# EAGLE design flying-horse-foot (EAGLE 9.6.2)
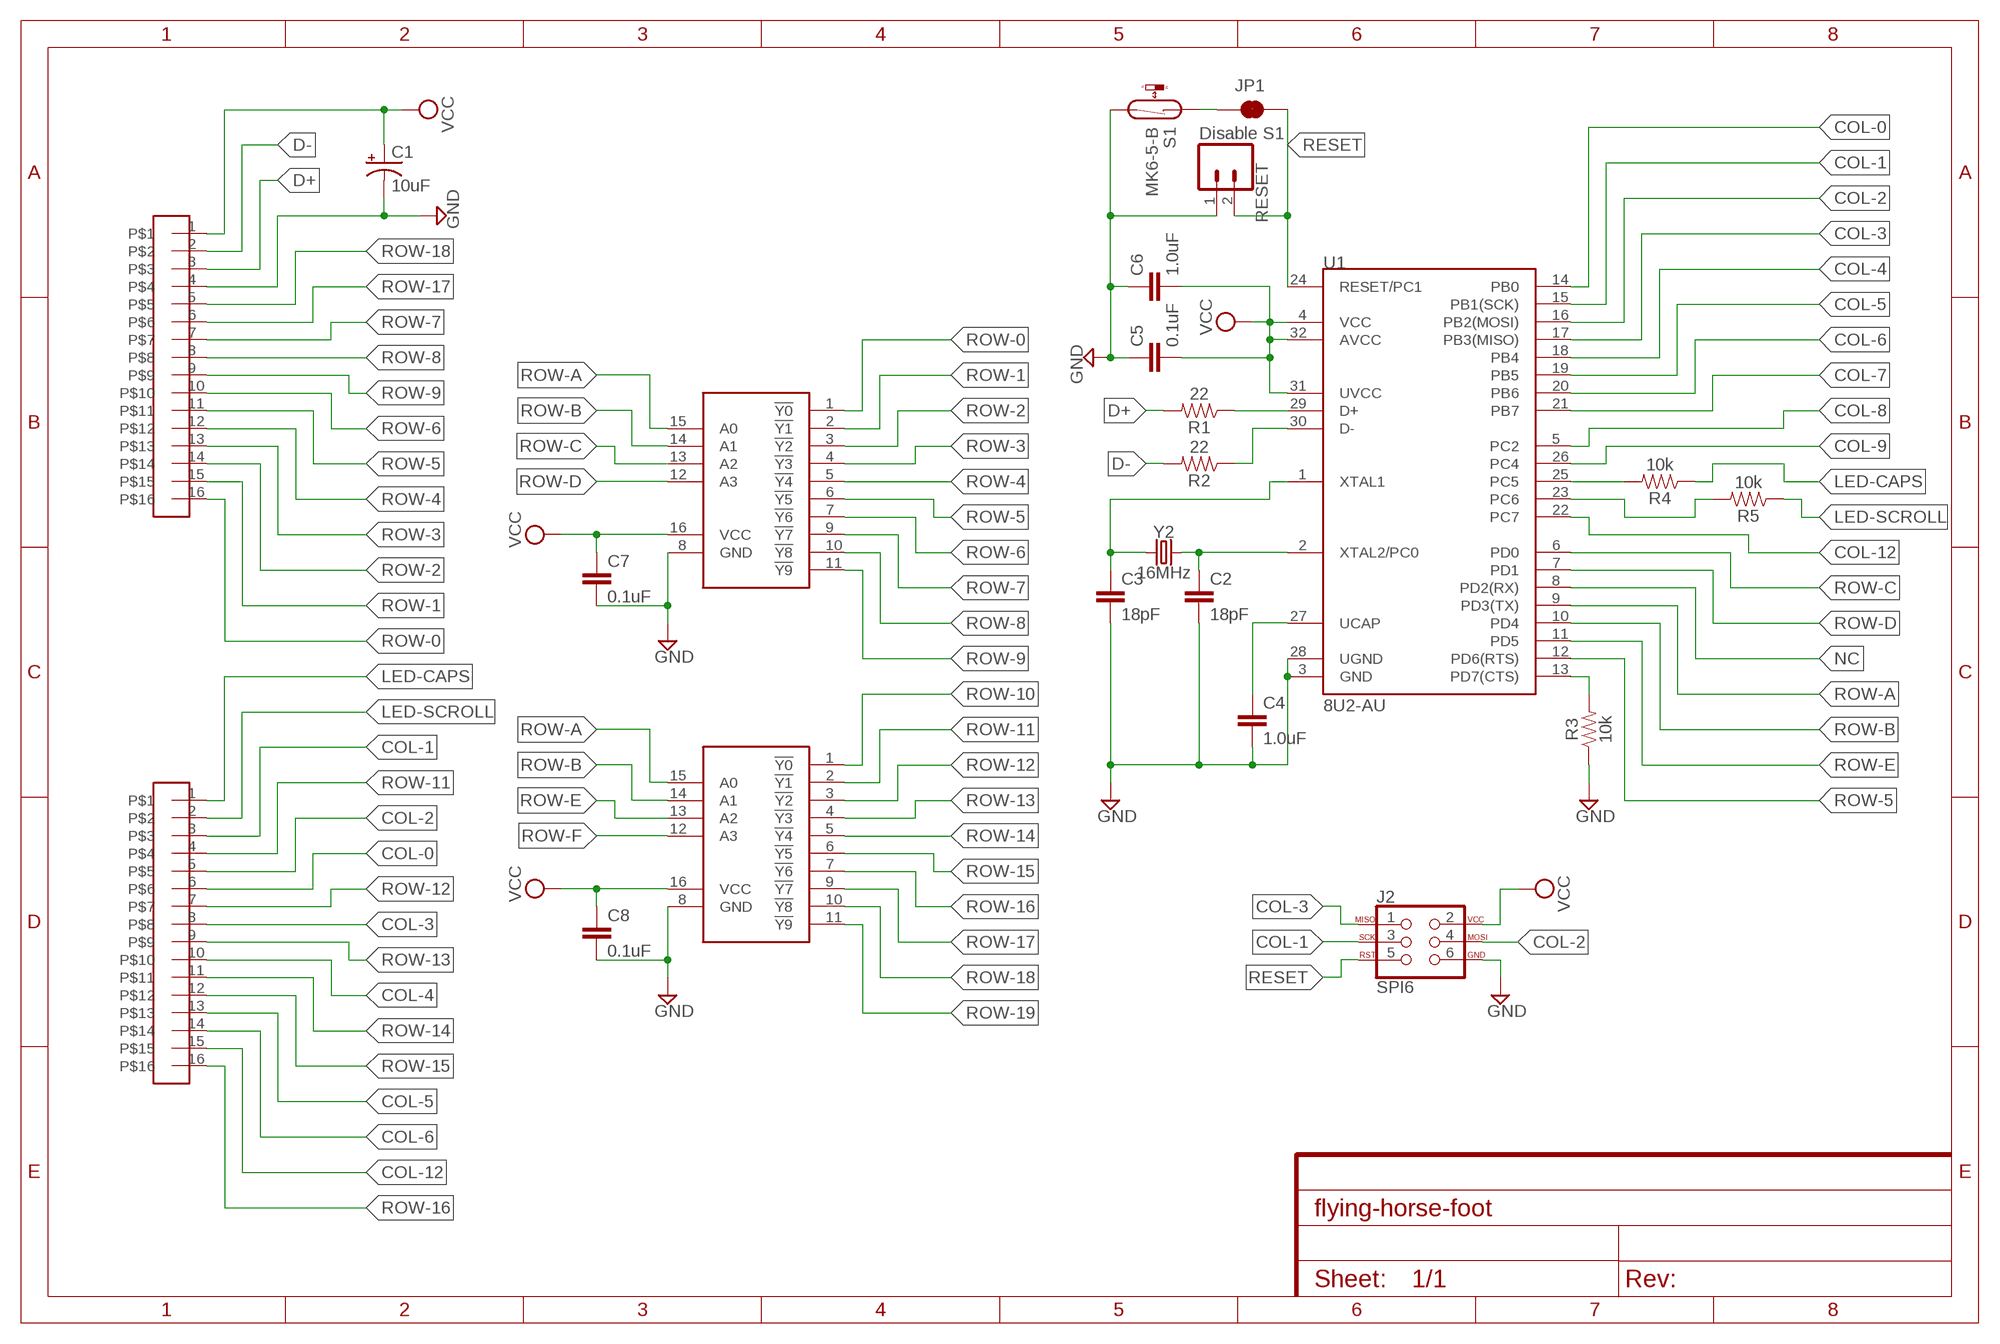
[diagram p0: schematic, sheet 1]

## Parts
C1  10uF  EEE-1CA100SR-EIA3528-20V-10%(TANT)  [EEE-1CA100SR]
C2  18pF  18PF-0603-50V-5%  [0603]
C3  18pF  18PF-0603-50V-5%  [0603]
C4  1.0uF  1.0UF-0603-16V-10%  [0603]
C5  0.1uF  0.1UF-0603-25V-5%  [0603]
C6  1.0uF  1.0UF-0603-16V-10%  [0603]
C7  0.1uF  0.1UF-0603-25V-5%  [0603]
C8  0.1uF  0.1UF-0603-25V-5%  [0603]
J2  SPI6  AVR_SPI_PROG_3X2NS  [2X3-NS]
JP1  Disable S1  JUMPER-SMT_2_NC_TRACE_NO-SILK  [SMT-JUMPER_2_NC_TRACE_NO-SILK]
R1  22  22OHM-0603-1/10W-1%  [0603]
R2  22  22OHM-0603-1/10W-1%  [0603]
R3  10k  10KOHM-0603-1/10W-1%  [0603]
R4  10k  10KOHM-0603-1/10W-1%  [0603]
R5  10k  10KOHM-0603-1/10W-1%  [0603]
RESET  CONN_02  [1X02]
S1  MK6-5-B  REED-SWITCH-MK6-5-B  [MK6-5]
U1  8U2-AU  ATMEGA8U2AU  [TQFP32-08_MCU]
U$1  74HC42D16  [D16]
U$2  74HC42D16  [D16]
U$3  16PIN-2MM-HEADER  [16PIN-2MM-HEADER]
U$4  16PIN-2MM-HEADER  [16PIN-2MM-HEADER]
Y2  16MHz  CRYSTAL-16MHZSMD-5X3.2  [CRYSTAL-SMD-5X3.2-4PAD]

## Nets
COL-0: U1.14(PB0) U$4.6
COL-1: J2.3 U1.15(PB1(SCK)) U$4.3
COL-2: J2.4 U1.16(PB2(MOSI)) U$4.5
COL-3: J2.1 U1.17(PB3(MISO)) U$4.8
COL-4: U1.18(PB4) U$4.10
COL-5: U1.19(PB5) U$4.13
COL-6: U1.20(PB6) U$4.14
COL-7: U1.21(PB7)
COL-8: U1.5(PC2)
COL-9: U1.26(PC4)
COL-12: U1.22(PC7) U$4.15
D+: R1.2 U$3.3
D-: R2.2 U$3.2
GND: C1.- C2.2 C3.2 C4.2 C5.1 C6.1 C7.2 C8.2 J2.6 R3.1 RESET.1 S1.2 U1.3(GND) U1.28(UGND) U$1.8(GND) U$2.8(GND) U$3.4
HWB: R3.2 U1.13(PD7(CTS))
LED-CAPS: R4.1 U$4.1
LED-SCROLL: R5.1 U$4.2
N$1: R1.1 U1.29(D+)
N$2: R2.1 U1.30(D-)
N$3: C2.1 U1.2(XTAL2/PC0) Y2.3
N$4: C3.1 U1.1(XTAL1) Y2.1
N$5: R4.2 U1.25(PC5)
N$6: C4.1 U1.27(UCAP)
N$7: R5.2 U1.23(PC6)
N$8: JP1.1 S1.1
NC: U1.8(PD2(RX))
RESET: J2.5 JP1.2 RESET.2 U1.24(RESET/PC1)
ROW-0: U$1.1(!Y0) U$3.16
ROW-1: U$1.2(!Y1) U$3.15
ROW-2: U$1.3(!Y2) U$3.14
ROW-3: U$1.4(!Y3) U$3.13
ROW-4: U$1.5(!Y4) U$3.12
ROW-5: U1.12(PD6(RTS)) U$1.6(!Y5) U$3.11
ROW-6: U$1.7(!Y6) U$3.10
ROW-7: U$1.9(!Y7) U$3.7
ROW-8: U$1.10(!Y8) U$3.8
ROW-9: U$1.11(!Y9) U$3.9
ROW-10: U$2.1(!Y0)
ROW-11: U$2.2(!Y1) U$4.4
ROW-12: U$2.3(!Y2) U$4.7
ROW-13: U$2.4(!Y3) U$4.9
ROW-14: U$2.5(!Y4) U$4.11
ROW-15: U$2.6(!Y5) U$4.12
ROW-16: U$2.7(!Y6) U$4.16
ROW-17: U$2.9(!Y7) U$3.6
ROW-18: U$2.10(!Y8) U$3.5
ROW-19: U$2.11(!Y9)
ROW-A: U1.9(PD3(TX)) U$1.15(A0) U$2.15(A0)
ROW-B: U1.10(PD4) U$1.14(A1) U$2.14(A1)
ROW-C: U1.6(PD0) U$1.13(A2)
ROW-D: U1.7(PD1) U$1.12(A3)
ROW-E: U1.11(PD5) U$2.13(A2)
ROW-F: U$2.12(A3)
VCC: C1.+ C5.2 C6.2 C7.1 C8.1 J2.2 U1.4(VCC) U1.31(UVCC) U1.32(AVCC) U$1.16(VCC) U$2.16(VCC) U$3.1

## Library data of the parts
C1 = aaa2:EEE-1CA100SR: 10.0µF polarized capacitors A capacitor is a passive two-terminal electrical component used to store electrical energy temporarily in an electric field.; PROD_ID: CAP-08063
C2 C3 = SparkFun-Capacitors:18PF: 18pF ceramic capacitors A capacitor is a passive two-terminal electrical component used to store electrical energy temporarily in an electric field.; PROD_ID: CAP-08267
C4 C6 = SparkFun-Capacitors:1.0UF: 1µF ceramic capacitors A capacitor is a passive two-terminal electrical component used to store electrical energy temporarily in an electric field.; PROD_ID: CAP-00868
C5 C7 C8 = SparkFun-Capacitors:0.1UF: 0.1µF ceramic capacitors A capacitor is a passive two-terminal electrical component used to store electrical energy temporarily in an electric field.; PROD_ID: CAP-08604
J2 = SparkFun-Connectors:AVR_SPI_PROG_3X2: AVR ISP 6 Pin This is the reduced ISP connector for AVR programming. Common on Arduino. This footprint will take up less PCB space and can be used with a 10-pin to 6-pin adapter such as SKU: BOB-08508 **Special note about "TEST_POINT" package. The stop mask is on the top side, so if you want your programming test points to be on the bottom of your board, make sure to place this package on the bottom side of the board. This also ensure that the orientation to program from the bottom side will be correct. SparkFun Products: SparkFun ISP Pogo Adapter <https://www.sparkfun.com/products/11591> - NS Tiny AVR Programmer <https://www.sparkfun.com/products/11801> -PTH
JP1 = SparkFun-Jumpers:JUMPER-SMT_2_NC_TRACE: Normally closed trace jumper This jumper has a trace between two pads so it's normally closed (NC). Use a razor knife to open the connection. For best results follow the IPC guidelines for cutting traces: Cutout at least 0.063 mm (0.005 in). Remove all loose material to clean up the cut area. Seal the cut with an approved epoxy. Reapply solder to reclose the connection.
R1 R2 = SparkFun-Resistors:22OHM: 22Ω resistor A resistor is a passive two-terminal electrical component that implements electrical resistance as a circuit element. Resistors act to reduce current flow, and, at the same time, act to lower voltage levels within circuits. - Wikipedia; PROD_ID: RES-08698
R3-R5 = SparkFun-Resistors:10KOHM: 10kΩ resistor A resistor is a passive two-terminal electrical component that implements electrical resistance as a circuit element. Resistors act to reduce current flow, and, at the same time, act to lower voltage levels within circuits. - Wikipedia; PROD_ID: RES-00824
RESET = SparkFun-Connectors:CONN_02: Multi connection point. Often used as Generic Header-pin footprint for 0.1 inch spaced/style header connections On any of the 0.1 inch spaced packages, you can populate with these: Break Away Headers - Straight <https://www.sparkfun.com/products/116> (PRT-00116) Break Away Male Headers - Right Angle <https://www.sparkfun.com/products/553> (PRT-00553) Female Headers <https://www.sparkfun.com/products/115> (PRT-00115) Break Away Headers - Machine Pin <https://www.sparkfun.com/products/117> (PRT-00117) Break Away Female Headers - Swiss Machine Pin <https://www.sparkfun.com/products/743> (PRT-00743) For SCREWTERMINALS and SPRING TERMINALS visit here: Screw Terimnals on SparkFun.com <https://www.sparkfun.com/search/results?term=Screw+Terminals> (5mm/3.5mm/2.54mm spacing) This device is also useful as a general connection point to wire up your design to another part of your project. Our various solder wires solder well into these plated through hole pads. Hook-Up Wire - Assortment (Stranded, 22 AWG) <https://www.sparkfun.com/products/11375> (PRT-11375) Hook-Up Wire - Assortment (Solid Core, 22 AWG) <https://www.sparkfun.com/products/11367> (PRT-11367) View the entire wire category on our website here <https://www.sparkfun.com/categories/141> Special notes: Molex polarized connector foot print use with: PRT-08233 with associated crimp pins and housings. 2.54_SCREWTERM for use with PRT-10571. 3.5mm Screw Terminal footprints for PRT-08084 5mm Screw Terminal footprints for use with PRT-08432
S1 = switch-reed:REED-SWITCH-: Reed Sensor; MF: MEDER; MPN: MK6-5-B; OC_FARNELL: 1079479
U1 = SparkFun-Retired:ATMEGA8U2: Atmel 32-pin 8-bit Microcontroller with 8/16/32K Bystes of ISP Flash and USB Controller. ATmega8U2, ATmega16U2, and ATmega32U2 Datasheet SparkFun Products Storefront component: ATMEGA8U2-AU <https://www.sparkfun.com/products/13703> (COM-13703); PROD_ID: IC-10104
U$1 U$2 = aaa2:74HC42
U$3 U$4 = aaa2:16PIN-2MM-HEADER
Y2 = SparkFun-Clocks:CRYSTAL-16MHZ: 16MHz Crystal Digikey Example <http://www.digikey.com/product-search/en?keywords=535-9122-1-ND> Frequency: 16MHz Frequency Stability: ±50ppm Frequency Tolerance: ±20ppm Load Capacitance: 18pF SparkFun Products: Pro Micro -5V/16MHz <https://www.sparkfun.com/products/12640> SparkFun Serial Enabled LCD Kit <https://www.sparkfun.com/products/10097>; PROD_ID: XTAL-08218; SF_ID: COM-00094

## Board
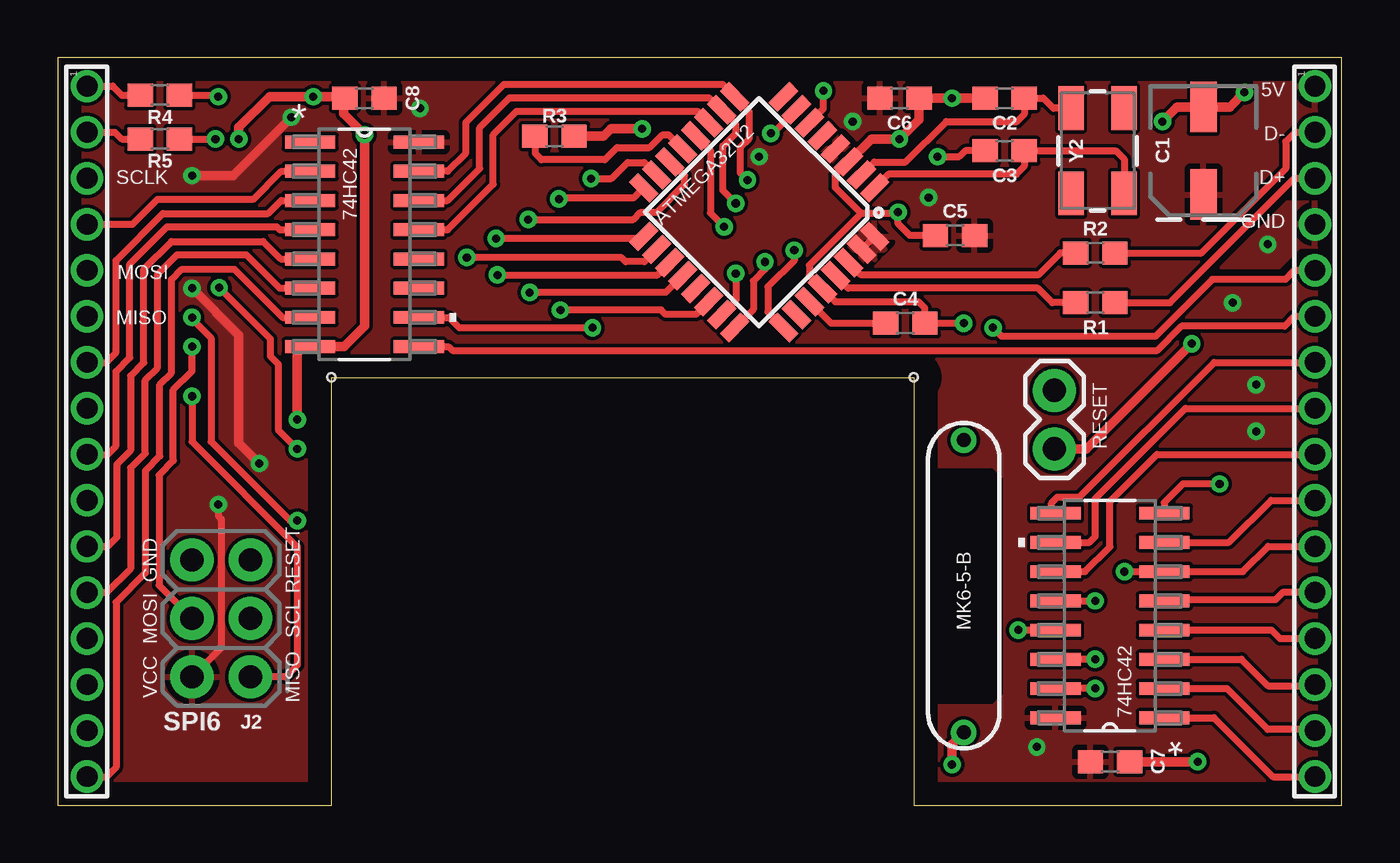
[diagram p1: board, top side]
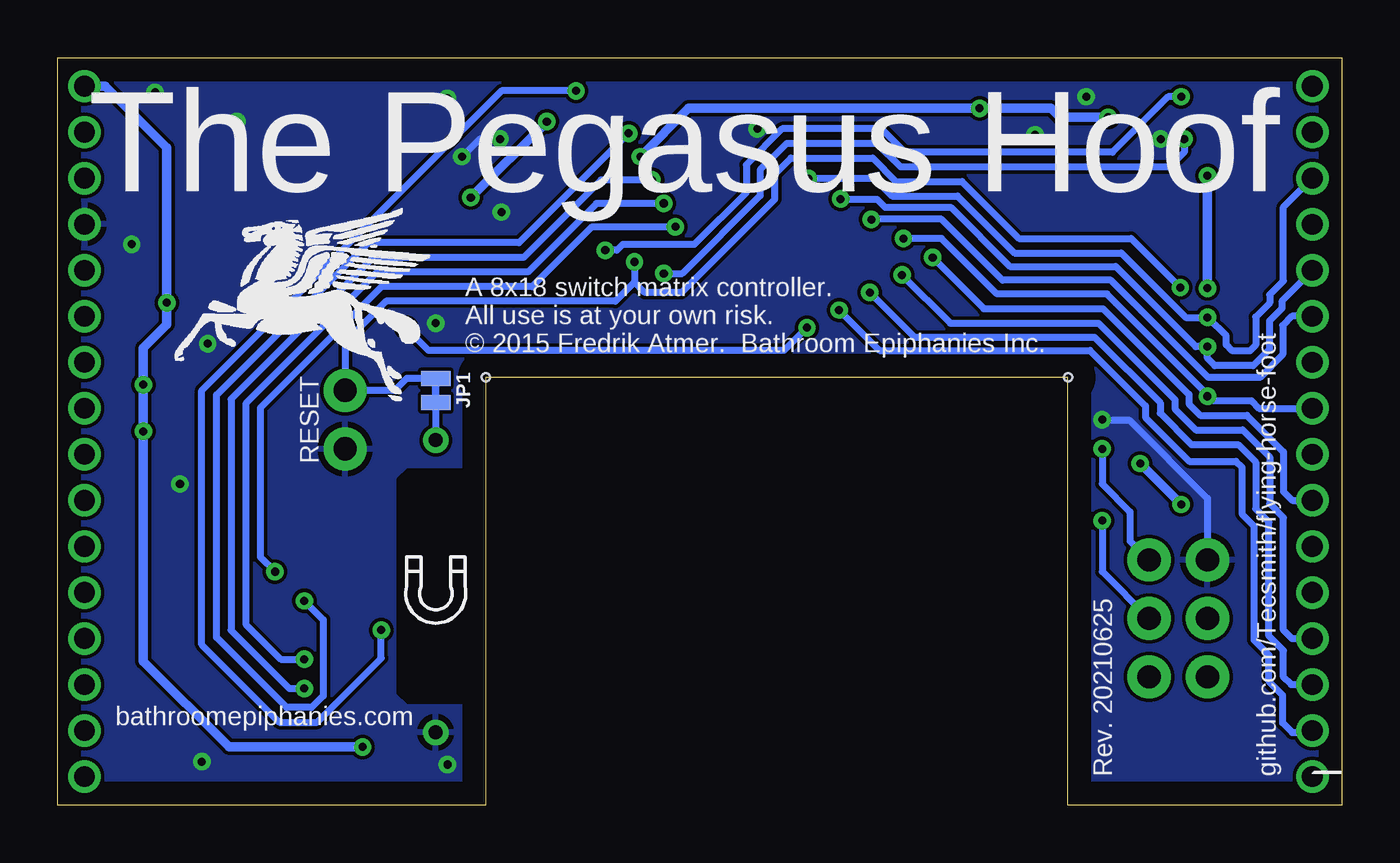
[diagram p2: board, bottom side, seen from below]

Size 55.8 x 32.5 mm. Coordinates in mm from the lower left corner, seen from the top.
Outline: 0,0 11.9,0 11.9,18.6 37.2,18.6 37.2,0 55.8,0 55.8,32.5 0,32.5 0,0
Copper layers (1*16): Top 0.035mm / dielectric 1.5mm / Bottom 0.035mm
Design rules "default": minimum track width 6mil, minimum drill 0.35mm, track to track 6mil, track to pad 6mil, pad to pad 6mil, via to via 6mil, smd to smd 6mil, copper to edge 40mil, drill to drill 6mil, minimum pad ring 10mil, minimum via ring 8mil, stop-mask expansion 4mil, vias tented up to drill 0mil, thermal gap 10mil
Holes 0.35 mm at 11.9,18.6 37.2,18.6

### Footprints (pad centres in the part's own frame; a part is rotated, then mirrored left to right if it is on the bottom)
EEE-1CA100SR = smd 1.15 x 2.2: + 0,-1.9; - 0,1.9
0603 = smd 1.1 x 1: 1 -0.85,0; 2 0.85,0
2X3-NS = drill 1.016 pad 1.88: 1 -2.54,-1.27; 2 -2.54,1.27; 3 0,-1.27; 4 0,1.27; 5 2.54,-1.27; 6 2.54,1.27
SMT-JUMPER_2_NC_TRACE_NO-SILK = smd 0.66 x 1.27: 1 -0.521,0; 2 0.521,0
1X02 = drill 1.016 pad 1.88: 1 0,0; 2 2.54,0
MK6-5 = drill 0.6 pad 1.016: 1 -6.35,0; 2 6.35,0
TQFP32-08_MCU = smd 1.27 x 0.559: 1 -4.293,2.8; 2 -4.293,2; 3 -4.293,1.2; 4 -4.293,0.4; 5 -4.293,-0.4; 6 -4.293,-1.2; 7 -4.293,-2; 8 -4.293,-2.8; 17 4.293,-2.8; 18 4.293,-2; 19 4.293,-1.2; 20 4.293,-0.4; 21 4.293,0.4; 22 4.293,1.2; 23 4.293,2; 24 4.293,2.8 | smd 0.559 x 1.27: 9 -2.8,-4.293; 10 -2,-4.293; 11 -1.2,-4.293; 12 -0.4,-4.293; 13 0.4,-4.293; 14 1.2,-4.293; 15 2,-4.293; 16 2.8,-4.293; 25 2.8,4.293; 26 2,4.293; 27 1.2,4.293; 28 0.4,4.293; 29 -0.4,4.293; 30 -1.2,4.293; 31 -2,4.293; 32 -2.8,4.293
D16 = smd 2.184 x 0.559: 1 -2.362,4.445; 2 -2.362,3.175; 3 -2.362,1.905; 4 -2.362,0.635; 5 -2.362,-0.635; 6 -2.362,-1.905; 7 -2.362,-3.175; 8 -2.362,-4.445; 9 2.362,-4.445; 10 2.362,-3.175; 11 2.362,-1.905; 12 2.362,-0.635; 13 2.362,0.635; 14 2.362,1.905; 15 2.362,3.175; 16 2.362,4.445
16PIN-2MM-HEADER = drill 0.9 pad 1.27: 1 -15,-1; 2 -13,-1; 3 -11,-1; 4 -9,-1; 5 -7,-1; 6 -5,-1; 7 -3,-1; 8 -1,-1; 9 1,-1; 10 3,-1; 11 5,-1; 12 7,-1; 13 9,-1; 14 11,-1; 15 13,-1; 16 15,-1
CRYSTAL-SMD-5X3.2-4PAD = smd 1.9 x 1.1: 1 -1.85,-1.15; 2 1.85,-1.15; 3 1.85,1.15; 4 -1.85,1.15

### Placement (x,y rotation side)
C1  49.78,28.45 0 top
C2  41.15,30.73 180 top
C3  41.15,28.45 180 top
C4  36.83,20.95 0 top
C5  38.99,24.77 0 top
C6  36.58,30.73 180 top
C7  45.72,1.91 0 top
C8  13.34,30.73 180 top
J2  7.11,8.13 90 top
JP1  39.37,18.03 90 bottom
R1  45.09,21.84 0 top
R2  45.09,24 0 top
R3  21.59,29.08 180 top
R4  4.45,30.86 0 top
R5  4.45,28.96 0 top
RESET  43.31,15.49 90 top
S1  39.37,9.53 270 top
U1  30.48,25.78 225 top
U$1  45.72,8.26 180 top
U$2  13.34,24.38 0 top
U$3  55.63,16.26 270 top
U$4  2.29,16.26 270 top
Y2  45.19,28.45 90 top

### Tracks (layer width: path | path; a pad name or v marks a point on that pad's centre or on a via)
COL-0  (via drill 0.35)
  Top 0.305: v20.45,25.46 25.02,25.46 25.34,25.78 26.04,25.78 27.24,26.99 27.24,27.37 26.64,27.97 U1.14
  Bottom 0.305: v20.45,25.46 20.43,25.48 17.4,25.48 14.75,22.82 10.03,22.82 5.81,18.61 3.56,18.61 2.57,19.59 2.57,20.86 2.17,21.26 U$4.6
COL-1  (via drill 0.35)
  Top 0.305: v23.18,27.24 24.07,27.24 24.77,27.94 25.49,27.94 U1.15 | v5.84,21.21 5.84,21.14 6.67,20.32 6.67,15.81 10.1,12.38 v10.41,12.38
  Bottom 0.305: v23.18,27.24 23.16,27.26 20.32,27.26 19.54,26.48 16.7,26.48 14.22,24 9.59,24 6.79,21.21 v5.84,21.21 5.83,21.21 5.03,20.41 5.03,20.02 4.76,19.75 4,19.75 3.75,20 3.75,21.23 3.14,21.84 3.14,22.19 2.54,22.8 2.54,26 U$4.3 | v10.41,12.38 10.41,10.16 J2.3
COL-2  (via drill 0.35)
  Top 0.305: v21.78,26.35 21.82,26.39 25.02,26.39 U1.16 | v5.84,19.94 5.84,18.87 5.03,18.06 5.03,14.98 4.41,14.36 4.41,9.56 J2.4
  Bottom 0.305: v21.78,26.35 21.77,26.34 20.19,26.34 19.85,26 17,26 14.42,23.42 9.83,23.42 6.35,19.94 v5.84,19.94 5.84,19.43 5.52,19.11 3.85,19.11 3.16,19.81 3.16,21.05 2.61,21.59 2.61,21.91 1.29,23.24 U$4.5
COL-3  (via drill 0.35)
  Top 0.305: 25.38,24.64 U1.17 25.37,24.64 24.13,24.64 v19.05,24.64 | v5.84,17.78 5.84,15.81 10.41,11.24 10.41,6.1 9.91,5.59 J2.1
  Bottom 0.305: v19.05,24.64 17.4,24.64 14.99,22.23 10.21,22.23 5.84,17.86 v5.84,17.78 5.78,17.78 5.59,17.59 3.94,17.59 3.6,17.26 U$4.8
COL-4  (via drill 0.35)
  Top 0.305: 26.03,24.15 U1.18 25.49,23.62 24.69,23.62 24.51,23.8 17.78,23.8 v17.78,23.81
  Bottom 0.305: v17.78,23.81 15.56,21.59 10.38,21.59 6.65,17.86 6.65,17.45 6.16,16.95 4.13,16.95 2.54,15.37 2.54,13.64 2.16,13.26 U$4.10
COL-5  (via drill 0.35)
  Top 0.305: U1.19 26.04,23.04 19.13,23.04 v19.11,23.05
  Bottom 0.305: v19.11,23.05 17.02,20.95 10.58,20.95 7.26,17.63 7.26,17.23 6.35,16.32 4.32,16.32 3.14,15.14 3.14,13.11 2.54,12.51 2.54,7.62 2.18,7.26 U$4.13
COL-6  (via drill 0.35)
  Top 0.305: U1.20 26.42,22.29 v20.51,22.29
  Bottom 0.305: v20.51,22.29 18.57,20.35 10.75,20.35 7.9,17.5 7.9,17.04 6.54,15.68 4.51,15.68 3.75,14.92 3.75,12.89 3.17,12.32 3.17,7.37 2.54,6.73 2.54,5.59 2.21,5.26 U$4.14
COL-12  (via drill 0.35)
  Top 0.305: U1.22 27.73,21.34 26.42,21.34 26.23,21.53 v21.84,21.53
  Bottom 0.305: v21.84,21.53 20.09,19.77 10.94,19.77 8.54,17.37 8.54,16.86 6.64,14.95 4.6,14.95 4.35,14.7 4.35,12.67 3.81,12.13 3.81,7.18 3.17,6.54 3.17,5.4 2.57,4.79 2.57,3.59 2.16,3.17 1.37,3.17 U$4.15
D+
  Top 0.305: R1.2 48.33,21.84 53.74,27.26 U$3.3
D-
  Top 0.305: R2.2 49.69,24 53.36,27.67 53.36,28.85 53.77,29.26 U$3.2
GND  (via drill 0.35)
  Top 0.305: C5.1 37.02,24.77 36.51,25.27 v36.51,25.78 36.47,25.74 34.92,25.74 | v50.48,13.97 48.9,13.97 48.08,13.16 U$1.8 | v38.23,28.19 39.18,28.19 39.43,28.45 C3.2 | 34.92,25.74 34.9,25.74 33.78,26.86 33.78,27.39 U1.3 | 34.92,25.74 32.66,23.47 32.66,23.03 U1.28 33.79,21.89 37.4,21.89 37.68,21.62 C4.2 v39.37,20.95
  Top 0.406: v38.86,1.78 38.86,2.67 S1.2 | C7.2 v49.53,1.91 | 12.42,30.8 12.42,30.06 v13.34,29.15 13.34,20.83 12.45,19.94 U$2.8 10.72,19.94 10.41,19.63 v10.41,16.76 | 12.42,30.8 v11.11,30.8 9.21,30.8 7.87,29.46 v7.87,28.96 | 12.42,30.8 C8.2 | 34.38,27.97 U1.3 35.35,28.96 v36.58,28.96 37.43,29.81 C6.1 v38.86,30.73 C2.2 | v48.01,29.72 48.64,30.35 C1.- 50.92,30.35 v51.56,30.99 | R3.1 23.71,29.08 24.05,29.42 25.38,29.42 v25.4,29.4 | RESET.1 44.7,15.49 v49.28,20.07
  Bottom 0.305: v10.41,16.76 10.4,16.75 9.24,16.75 5.84,13.35 J2.6 | v36.58,28.96 37.47,28.96 v38.23,28.19
  other vias: 52.58,24.38
  pour Bottom: 0.13,0 11.68,0 11.68,18.8 37.47,18.8 37.47,15.11 37.85,14.73 40.64,14.73 41.15,14.22 41.15,4.83 40.64,4.32 37.85,4.32 37.47,3.94 37.47,0 55.5,0 55.5,32.38 0.13,32.38
  pour Top: 50.55,23.37 53.4,26.23 55.12,26.23 55.12,24.26 53.98,24.26 53.09,23.37
HWB
  Top 0.305: R3.2 20.76,29.07 | 20.76,29.07 20.87,28.96 | U1.13 26.55,29.15 26.29,29.15 25.73,28.59 24.31,28.59 23.79,28.06 21.02,28.06 20.76,28.33 20.76,29.07
LED-CAPS
  Top 0.305: U$4.1 2.4,31.26 2.79,30.86 R4.1
LED-SCROLL
  Top 0.305: U$4.2 2.49,29.26 2.79,28.96 R5.1
N$1
  Top 0.305: R1.1 43.22,21.84 42.58,22.48 34.35,22.48 U1.29
N$2
  Top 0.305: U1.30 34.91,23.05 42.61,23.05 43.56,24 R2.1
N$3
  Top 0.305: U1.2 35.48,27.96 36.85,27.96 38.61,29.72 41.68,29.72 42,30.04 C2.1 42.82,30.73 43.27,30.29 44.03,30.29 Y2.3
N$4
  Top 0.305: U1.1 36.09,27.43 41.66,27.43 42,27.77 C3.1 45.97,28.45 46.34,28.09 Y2.1
N$5  (via drill 0.35)
  Top 0.305: R4.2 6.92,30.86 v6.99,30.8 | U1.25 30.86,21.44 30.86,22.54 32,23.69 v32,24.13
  Bottom 0.305: v6.99,30.8 7.56,30.8 9.97,28.38 18.99,28.38 20,29.4 24.32,29.4 25.88,27.84 25.88,26.64 28.13,24.38 31.24,24.38 31.5,24.13 v32,24.13
N$6
  Top 0.305: U1.27 33.61,20.95 C4.1
N$7  (via drill 0.35)
  Top 0.305: R5.2 v6.86,28.96 | v29.46,23.11 29.46,21.94 U1.23
  Bottom 0.305: v29.46,23.11 28.65,23.11 25.27,26.49 25.27,27.62 24.13,28.77 20.19,28.77 19.18,27.75 7.49,27.75 6.86,28.38 v6.86,28.96
N$8
  Bottom 0.305: JP1.1 S1.1
RESET  (via drill 0.35)
  Top 0.305: U1.24 29.44,20.77 30.23,21.55 30.23,22.8 30.73,23.3 v30.73,23.62 | v10.41,15.49 9.59,16.32 9.59,19.18 9.25,19.52 9.25,20.28 v7.02,22.5
  Bottom 0.305: v30.73,23.62 30.73,22.73 | v10.41,15.49 10.41,13.97 9.21,12.76 9.21,11.49 J2.5 | v7.02,22.5 9.16,24.64 14.03,24.64 16.51,27.11 19.37,27.11 20.38,28.13 23.94,28.13 24.64,27.43 24.64,26.35 28.7,22.29 30.29,22.29 30.73,22.73 | 30.73,22.73 31.56,21.91 41.53,21.91 43.31,20.13 RESET.2 41.15,18.03 40.63,18.55 JP1.2
ROW-0
  Top 0.305: U$1.1 50.24,3.81 52.8,1.26 U$3.16
ROW-1
  Top 0.305: U$1.2 50.8,5.08 52.58,3.3 54.58,3.3 U$3.15
ROW-2
  Top 0.305: U$1.3 51.44,6.35 52.58,5.21 54.58,5.21 U$3.14
ROW-3
  Top 0.305: U$1.4 52.74,7.62 53.1,7.26 U$3.13
ROW-4
  Top 0.305: U$1.5 48.13,8.94 52.91,8.94 53.23,9.26 U$3.12
ROW-5  (via drill 0.35)
  Top 0.305: U$3.11 52.59,11.26 51.5,10.16 U$1.6 v46.35,10.16 | U1.12 28.36,28.46 28.36,25.74 v28.96,25.15
  Bottom 0.305: v46.35,10.16 46.99,10.79 46.99,17.27 41.72,22.54 35.18,22.54 32.58,25.15 v28.96,25.15
ROW-6
  Top 0.305: U$1.7 50.9,11.43 52.72,13.26 U$3.10
ROW-7
  Top 0.305: U$3.7 50.24,19.26 44.39,13.4 43.43,13.4 43.18,13.14 43.18,12.88 U$1.9
ROW-8
  Top 0.305: U$1.10 44.83,11.43 45.09,11.68 45.09,13.34 49.01,17.26 U$3.8
ROW-9
  Top 0.305: U$1.11 44.64,10.16 45.72,11.24 45.72,13.21 47.77,15.26 U$3.9
ROW-11
  Top 0.305: U$2.2 9.72,27.56 8.49,26.34 4.33,26.34 3.25,25.26 U$4.4
ROW-12
  Top 0.305: U$4.7 2.11,19.26 2.54,19.68 2.54,23.69 4.57,25.72 9.14,25.72 9.72,26.29 U$2.3
ROW-13
  Top 0.305: U$4.9 2.17,15.26 2.54,15.62 2.54,18.86 3.14,19.46 3.14,23.53 4.75,25.13 9.54,25.13 9.65,25.02 U$2.4
ROW-14
  Top 0.305: U$4.11 2.17,11.26 2.57,11.65 2.57,14.83 3.17,15.43 3.17,18.67 3.75,19.24 3.75,23.3 4.95,24.51 8.94,24.51 9.7,23.75 U$2.5
ROW-15
  Top 0.305: U$4.12 2.14,9.26 3.17,10.29 3.17,14.67 3.81,15.3 3.81,18.48 4.35,19.02 4.35,23.08 5.19,23.93 8.2,23.93 9.65,22.48 U$2.6
ROW-16
  Top 0.305: U$4.16 2.15,1.26 2.54,1.65 2.54,8.83 3.81,10.1 3.81,14.54 4.45,15.18 4.45,18.29 4.95,18.8 4.95,22.86 5.4,23.3 7.68,23.3 9.78,21.21 U$2.7
ROW-17
  Top 0.305: U$2.9 16.98,19.94 17.16,19.77 47.77,19.77 48.83,20.83 53.31,20.83 53.74,21.26 U$3.6
ROW-18  (via drill 0.35)
  Top 0.305: U$2.10 17,21.21 17.45,20.77 v23.24,20.77 | U$3.5 53.74,23.26 53.34,22.86 50.16,22.86 47.69,20.38 41.02,20.38 v40.64,20.77
  Bottom 0.305: v23.24,20.77 24.24,19.77 39.69,19.77 40.64,20.72 v40.64,20.77
ROW-A  (via drill 0.35)
  Top 0.305: U$2.15 16.95,27.56 17.75,28.35 17.75,29.69 19.39,31.33 28.89,31.33 U1.9 30.04,30.18 30.04,28.96 29.65,28.57 29.65,27.5 v29.97,27.18 | v45.09,5.08 U$1.15
  Bottom 0.305: v29.97,27.18 32.19,27.18 35.56,23.81 42.1,23.81 48.26,17.65 48.26,7.61 45.73,5.08 v45.09,5.08
ROW-B  (via drill 0.35)
  Top 0.305: v29.46,26.16 28.91,26.72 28.91,28.65 29.46,29.21 29.46,29.62 U1.10 28.82,30.23 28.31,30.75 19.64,30.75 18.34,29.45 18.34,27.67 16.95,26.29 U$2.14 | v45.09,6.35 U$1.14
  Bottom 0.305: v29.46,26.16 32.38,26.16 35.37,23.18 41.91,23.18 47.62,17.46 47.62,7.87 46.1,6.35 v45.09,6.35
ROW-C  (via drill 0.35)
  Top 0.305: U1.6 33.27,30.27 v33.27,31.05 | 43.31,7.67 U$1.13 v41.73,7.62
  Bottom 0.305: v33.27,31.05 36.51,31.05 49.53,18.03 49.53,6.99 46.16,3.62 44.51,3.62 41.73,6.4 v41.73,7.62
ROW-D  (via drill 0.35)
  Top 0.305: U1.7 31.08,29.21 v30.99,29.21 | U$1.12 v45.09,8.89
  Bottom 0.305: v30.99,29.21 35.75,24.45 42.29,24.45 48.9,17.84 48.9,7.3 45.85,4.25 44.77,4.25 44.26,4.76 44.26,8.06 v45.09,8.89
ROW-E
  Top 0.305: U1.11 28.29,29.68 27.81,30.16 19.94,30.16 18.92,29.15 18.92,26.99 16.95,25.02 U$2.13
VCC  (via drill 0.35)
  Top 0.305: U$1.16 43.17,3.62 | U$3.1 54.48,31.11 | 35.73,30.59 C6.2 | U1.32 U1.31 34.9,24.16 | v6.99,13.08 6.99,12.57 7.11,12.45 7.11,6.86 J2.2
  Top 0.406: v5.84,22.48 7.87,20.45 7.87,15.75 v8.76,14.86 | v5.84,27.37 7.62,27.37 v10.16,29.91
  Bottom 0.305: J2.2 5.8,5.59
  Bottom 0.406: U$3.1 53.74,31.26 51.05,28.57 v51.05,21.84 51.05,20.89 52.07,19.88 v52.07,18.29 v52.07,16.26 52.07,6.27 48.34,2.54 v42.55,2.54 | v30.48,28.19 28.38,30.29 v15.75,30.29 12.64,30.29 12.26,29.91 v10.16,29.91 | v34.54,29.72 v37.85,26.42 | v8.76,14.86 v6.99,13.08 | v5.84,27.37 v5.84,22.48
  pour Top: 0.13,0 11.68,0 11.68,18.8 37.48,18.8 37.47,15.11 37.85,14.73 40.64,14.73 41.15,14.22 41.15,4.83 40.64,4.32 37.85,4.32 37.47,3.94 37.47,0 55.37,0 55.5,22.1 54.74,22.86 49.28,22.86 53.09,26.67 54.61,26.67 55.5,27.56 55.5,32.38 0.13,32.38

### Text on the board
tPlace: 5V | 74HC42 | D- | SCLK | D+ | ATMEGA32U2 | GND | MOSI | MISO | RESET | MK6-5-B | 74HC42
tNames: GND | RESET | MOSI | SCL | VCC | MISO | SPI6
bNames: The Pegasus Hoof | A 8x18 switch matrix controller. / All use is at your own risk. / © 2015 Fredrik Atmer. Bathroom Epiphanies Inc. | RESET | bathroomepiphanies.com | github.com/Tecsmith/flying-horse-foot | Rev. 20210625